# Altium schematic sheet FE_Channel.SchDoc: ThunderScope 1000E
size A3; DrawnBy: Aleksa Bjelogrlic; Revision: 1
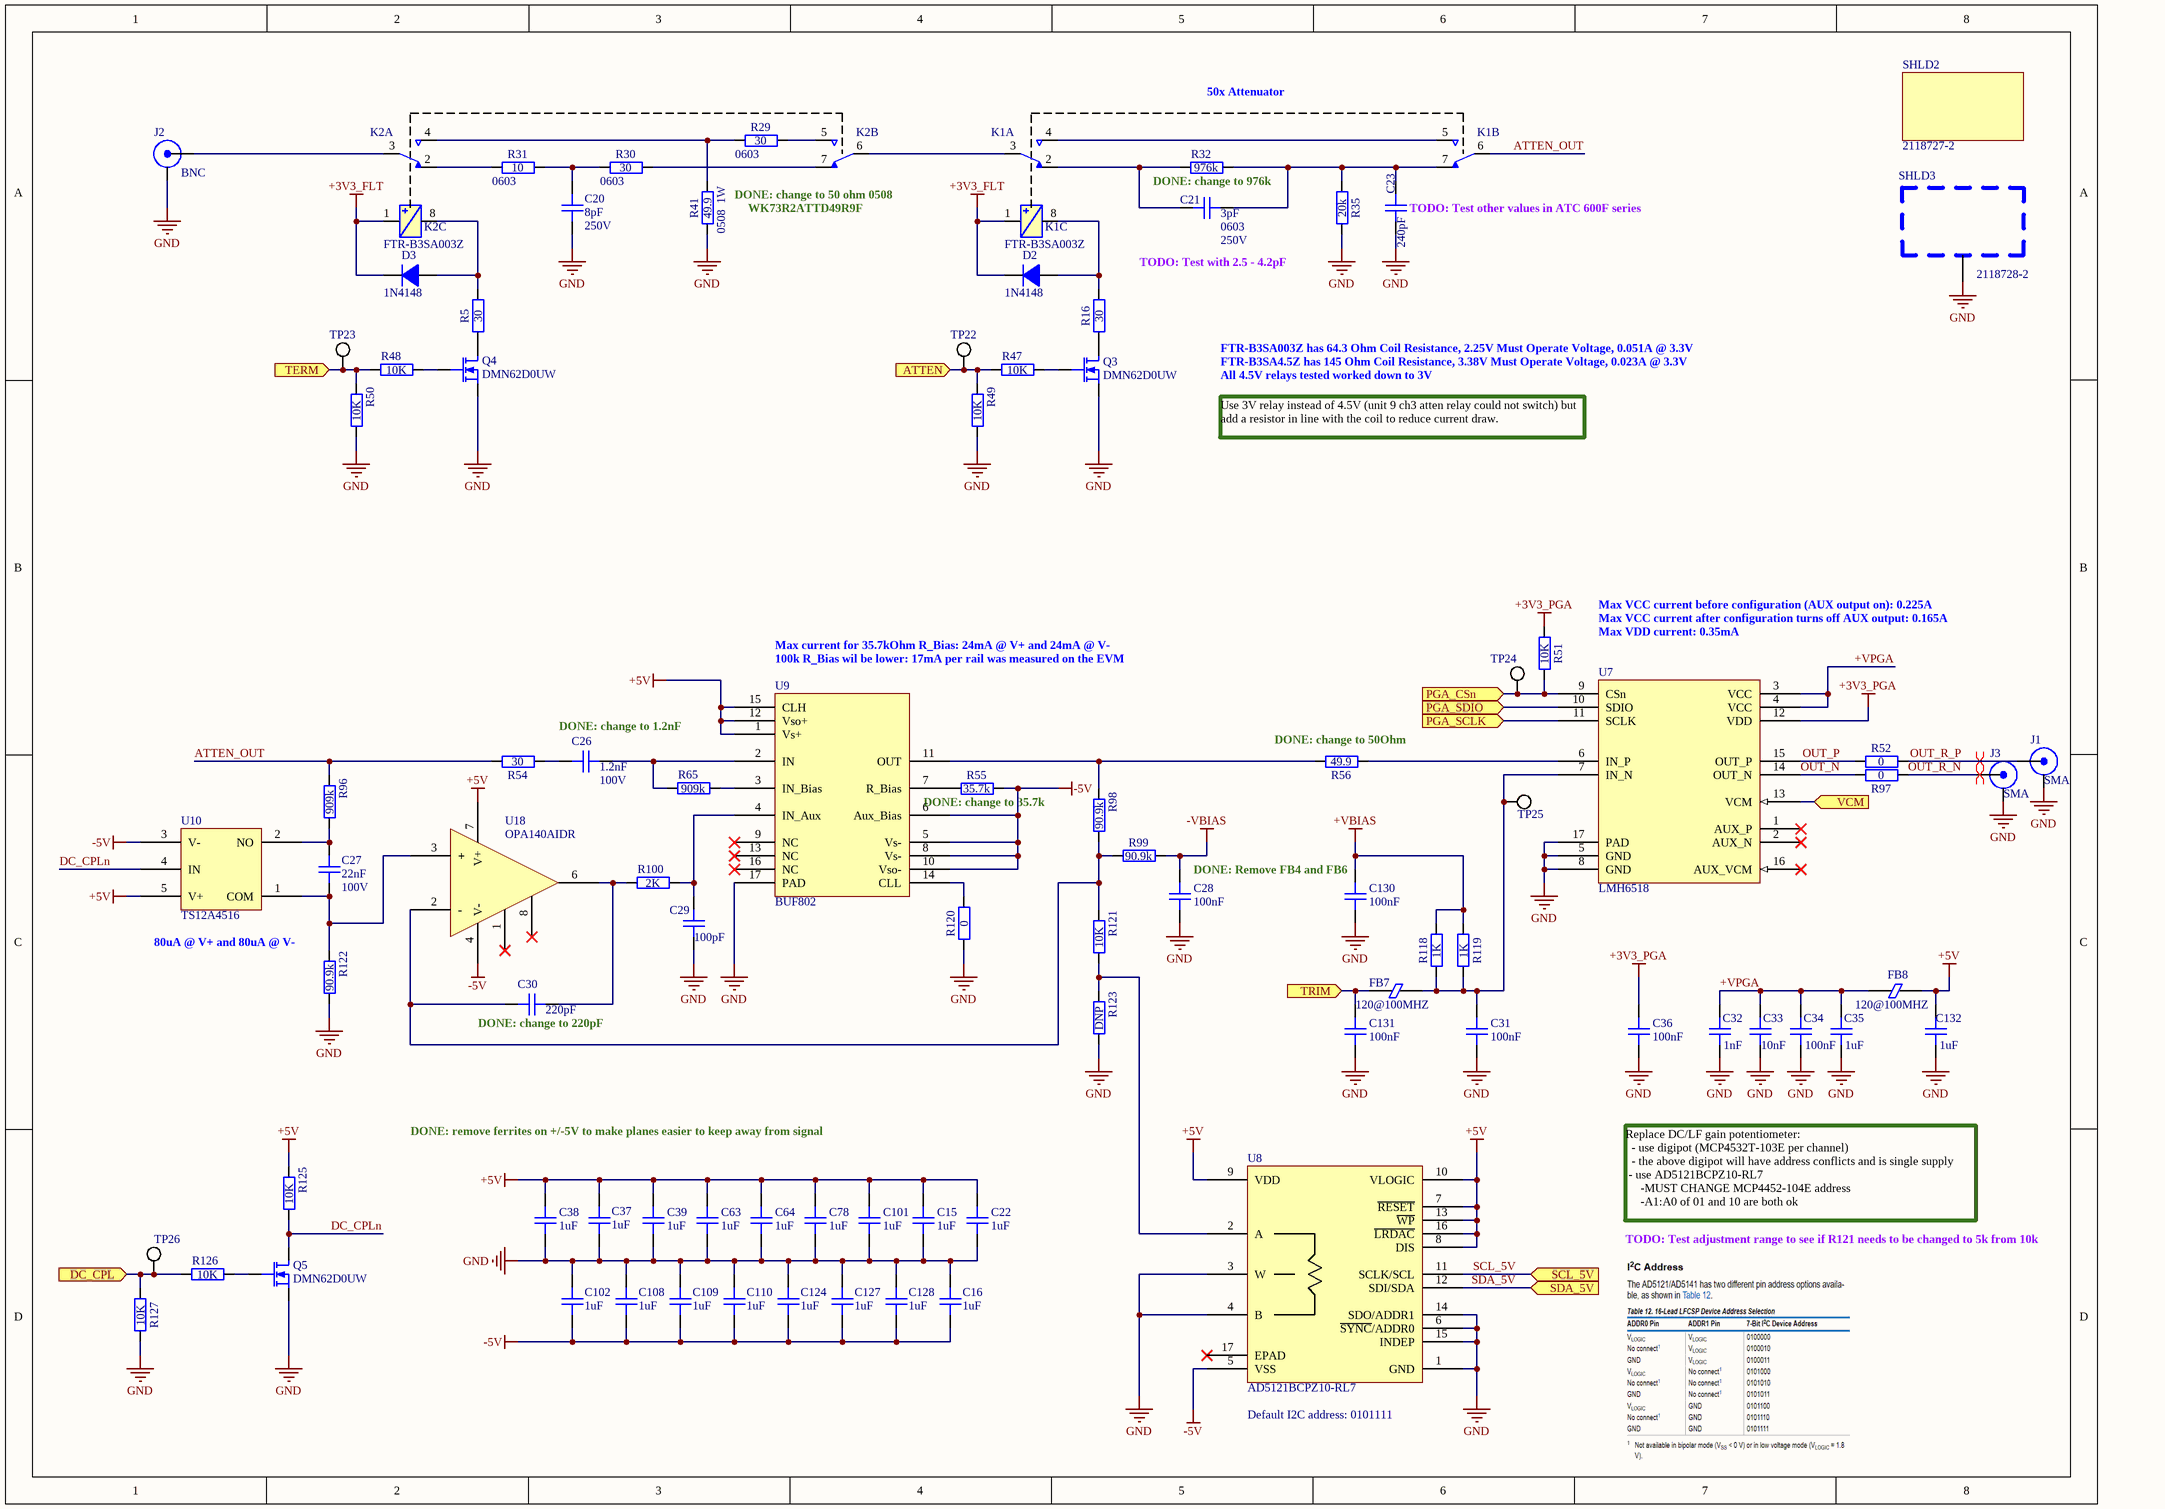
[diagram p0: FE_Channel.SchDoc]

## Parts
C15  1uF  [GEN_C_0402]
C16  1uF  [GEN_C_0402]
C20  8pF  Voltage Rating: 250V  [GEN_C_0603]
C21  3pF  Package: 0603  Voltage Rating: 250V  [GEN_C_0603]
C22  1uF  [GEN_C_0402]
C23  240pF  [GEN_C_0805]
C26  1.2nF  Voltage Rating: 100V  [GEN_C_0603]
C27  22nF  Voltage Rating: 100V  [GEN_C_0603]
C28  100nF  [GEN_C_0402]
C29  100pF  [GEN_C_0402]
C30  220pF  [GEN_C_0402]
C31  100nF  [GEN_C_0402]
C32  1nF  [GEN_C_0402]
C33  10nF  [GEN_C_0402]
C34  100nF  [GEN_C_0402]
C35  1uF  [GEN_C_0402]
C36  100nF  [GEN_C_0402]
C37  1uF  [GEN_C_0402]
C38  1uF  [GEN_C_0402]
C39  1uF  [GEN_C_0402]
C63  1uF  [GEN_C_0402]
C64  1uF  [GEN_C_0402]
C78  1uF  [GEN_C_0402]
C101  1uF  [GEN_C_0402]
C102  1uF  [GEN_C_0402]
C108  1uF  [GEN_C_0402]
C109  1uF  [GEN_C_0402]
C110  1uF  [GEN_C_0402]
C124  1uF  [GEN_C_0402]
C127  1uF  [GEN_C_0402]
C128  1uF  [GEN_C_0402]
C130  100nF  [GEN_C_0402]
C131  100nF  [GEN_C_0402]
C132  1uF  [GEN_C_0402]
D2  1N4148  [GEN_SOD_323]
D3  1N4148  [GEN_SOD_323]
FB7  120@100MHZ  [GEN_R_0402]
FB8  120@100MHZ  [GEN_R_0402]
J1  SMA  [MOL_0733910083]
J2  BNC  [MOL_0731000105]
J3  SMA  [MOL_0733910083]
K1  FTR-B3SA003Z  [FUJ_FTR-B3SA]  (value not drawn)  (parts A,B,C of 3)
K2  FTR-B3SA003Z  [FUJ_FTR-B3SA]  (value not drawn)  (parts A,B,C of 3)
Q3  DMN62D0UW  [GEN_SOT_323]
Q4  DMN62D0UW  [GEN_SOT_323]
Q5  DMN62D0UW  [GEN_SOT_323]
R5  30  [GEN_R_0603]
R16  30  [GEN_R_0603]
R29  30  Package: 0603  [GEN_R_0603]
R30  30  Package: 0603  [GEN_R_0603]
R31  10  Package: 0603  [GEN_R_0603]
R32  976k  [GEN_R_0603]
R35  20k  [GEN_R_0402]
R41  49.9  Package: 0508  Power Rating: 1W  [GEN_R_0508]
R47  10K  [GEN_R_0402]
R48  10K  [GEN_R_0402]
R49  10K  [GEN_R_0402]
R50  10K  [GEN_R_0402]
R51  10K  [GEN_R_0402]
R52  0  [GEN_R_0402]
R54  30  [GEN_R_0603]
R55  35.7k  [GEN_R_0402]
R56  49.9  [GEN_R_0402]
R65  909k  [GEN_R_0402]
R96  909k  [GEN_R_0402]
R97  0  [GEN_R_0402]
R98  90.9k  [GEN_R_0402]
R99  90.9k  [GEN_R_0402]
R100  2K  [GEN_R_0402]
R118  1K  [GEN_R_0402]
R119  1K  [GEN_R_0402]
R120  0  [GEN_R_0402]
R121  10K  [GEN_R_0402]
R122  90.9k  [GEN_R_0402]
R123  DNP  [GEN_R_0402]  (no BOM)
R125  10K  [GEN_R_0402]
R126  10K  [GEN_R_0402]
R127  10K  [GEN_R_0402]
SHLD2  2118727-2  (mechanical)
SHLD3  2118728-2  [TE_2118728-2]
TP22  PCB  [GEN_TP_PCB]  (value not drawn)  (no BOM)
TP23  PCB  [GEN_TP_PCB]  (value not drawn)  (no BOM)
TP24  PCB  [GEN_TP_PCB]  (value not drawn)  (no BOM)
TP25  PCB  [GEN_TP_PCB]  (value not drawn)  (no BOM)
TP26  PCB  [GEN_TP_PCB]  (value not drawn)  (no BOM)
U7  LMH6518  [TI_WQFN_RGH0016A]
U8  AD5121BCPZ10-RL7  [AD_QFN16_CP-16-22]
U9  BUF802  [TI_VQFN_RGT0016C]
U10  TS12A4516  [GEN_SOT23_5_950_2900X1600X1450]
U18  OPA140AIDR  [TI_SOIC8_D0008A]

## Ports
ATTEN (in), DC_CPL (in), PGA_CSn (in), PGA_SCLK (in), PGA_SDIO (in), SCL_5V (in), SDA_5V (in), TERM (in), TRIM (in), VCM (in)

## Nets
+3V3_FLT: D2.1(K) D3.1(K) K1.1 K2.1
+3V3_PGA: C36.2 R51.2 U7.12(VDD)
+5V: C15.2 C22.2 C37.2 C38.1 C39.1 C63.1 C64.2 C78.2 C101.2 C132.2 FB8.2 R125.2 U8.7(~{RESET}) U8.8(DIS) U8.9(VDD) U8.10(VLOGIC) U8.13(~{WP}) U8.16(~{LRDAC}) U9.1(Vs+) U9.12(Vso+) U9.15(CLH) U10.5(V+) U18.7(V+)
+VBIAS: C130.1 R118.2 R119.1
-5V: C16.2 C102.2 C108.2 C109.1 C110.1 C124.1 C127.2 C128.2 R55.2 U8.5(VSS) U9.5(Vs-) U9.6(Aux_Bias) U9.8(Vs-) U9.10(Vso-) U10.3(V-) U18.4(V-)
-VBIAS: C28.1 R99.1
GND: C15.1 C16.1 C20.2 C22.1 C23.1 C28.2 C29.1 C31.2 C32.1 C33.1 C34.1 C35.1 C36.1 C37.1 C38.2 C39.2 C63.2 C64.1 C78.1 C101.1 C102.1 C108.1 C109.2 C110.2 C124.2 C127.1 C128.1 C130.2 C131.2 C132.1 J1.2(SHIELD) J2.2(SHIELD) J3.2(SHIELD) Q3.3(S) Q4.3(S) Q5.3(S) R35.1 R41.1 R49.1 R50.1 R120.1 R122.1 R123.1 R127.1 SHLD3.1 U7.5(GND) U7.8(GND) U7.17(PAD) U8.1(GND) U8.3(W) U8.4(B) U8.6(~{SYNC}/ADDR0) U8.14(SDO/ADDR1) U8.15(INDEP) U9.17(PAD)
+VPGA: C32.2 C33.2 C34.2 C35.2 FB8.1 U7.3(VCC) U7.4(VCC)
ATTEN: R47.2 R49.2 TP22.1 ; port ATTEN
ATTEN_OUT: K1.6 R54.1 R96.2
DC_CPL: R126.2 R127.2 TP26.1 ; port DC_CPL
DC_CPLn: Q5.1(D) R125.1 U10.4(IN)
OUT_N: R97.1 U7.14(OUT_N)
OUT_P: R52.1 U7.15(OUT_P)
OUT_R_N: J3.1(Signal) R97.2
OUT_R_P: J1.1(Signal) R52.2
PGA_CSn: R51.1 TP24.1 U7.9(CSn) ; port PGA_CSn
PGA_SCLK: U7.11(SCLK) ; port PGA_SCLK
PGA_SDIO: U7.10(SDIO) ; port PGA_SDIO
SCL_5V: U8.11(SCLK/SCL) ; port SCL_5V
SDA_5V: U8.12(SDI/SDA) ; port SDA_5V
TERM: R48.2 R50.2 TP23.1 ; port TERM
TRIM: C131.1 FB7.1 ; port TRIM
VCM: U7.13(VCM) ; port VCM
NetC20_1: C20.1 R30.1 R31.2
NetC21_1: C21.1 C23.2 K1.7 R32.2 R35.2
NetC21_2: C21.2 K1.2 R32.1
NetC26_1: C26.1 R65.2 U9.2(IN)
NetC26_2: C26.2 R54.2
NetC27_1: C27.1 R96.1 U10.2(NO)
NetC27_2: C27.2 R122.2 U10.1(COM) U18.3(+)
NetC29_2: C29.2 R100.1 U9.4(IN_Aux)
NetC30_1: C30.1 R100.2 U18.6(OUT)
NetC30_2: C30.2 R98.1 R99.2 R121.2 U18.2(-)
NetC31_1: C31.1 FB7.2 R118.1 R119.2 TP25.1 U7.7(IN_N)
NetD2_2: D2.2(A) K1.8 R16.2
NetD3_2: D3.2(A) K2.8 R5.2
NetJ2_1: J2.1(Signal) K2.3
NetK1_3: K1.3 K2.6
NetK1_4: K1.4 K1.5
NetK2_2: K2.2 R31.1
NetK2_4: K2.4 R29.1 R41.2
NetK2_5: K2.5 R29.2
NetK2_7: K2.7 R30.2
NetQ3_1: Q3.1(D) R16.1
NetQ3_2: Q3.2(G) R47.1
NetQ4_1: Q4.1(D) R5.1
NetQ4_2: Q4.2(G) R48.1
NetQ5_2: Q5.2(G) R126.1
NetR55_1: R55.1 U9.7(R_Bias)
NetR56_1: R56.1 R98.2 U9.11(OUT)
NetR56_2: R56.2 U7.6(IN_P)
NetR65_1: R65.1 U9.3(IN_Bias)
NetR120_2: R120.2 U9.14(CLL)
NetR121_1: R121.1 R123.2 U8.2(A)

Not connected (* = marked no-connect by the designer): U7 1(AUX_P)* 2(AUX_N)* 16(AUX_VCM)*; U8 17(EPAD)*; U9 9(NC)* 13(NC)* 16(NC)*; U18 1(N1)* 8(N2)*

## Layout directives
differential pair; differential pair class 100Z: OUT_R_N, OUT_R_P

## Notes on the sheet
- 50x Attenuator
- (near R32) DONE: change to 976k
- DONE: change to 50 ohm 0508
- WK73R2ATTD49R9F
- (near C23) TODO: Test other values in ATC 600F series
- TODO: Test with 2.5 - 4.2pF
- FTR-B3SA003Z has 64.3 Ohm Coil Resistance, 2.25V Must Operate Voltage, 0.051A @ 3.3V
- FTR-B3SA4.5Z has 145 Ohm Coil Resistance, 3.38V Must Operate Voltage, 0.023A @ 3.3V
- All 4.5V relays tested worked down to 3V
- Use 3V relay instead of 4.5V (unit 9 ch3 atten relay could not switch) but add a resistor in line with the coil to reduce current draw.
- Max current for 35.7kOhm R_Bias: 24mA @ V+ and 24mA @ V-
- Max VCC current before configuration (AUX output on): 0.225A
- Max VCC current after configuration turns off AUX output: 0.165A
- Max VDD current: 0.35mA
- (near U9) 100k R_Bias wil be lower: 17mA per rail was measured on the EVM
- DONE: change to 1.2nF
- (near R56) DONE: change to 50Ohm
- DONE: change to 35.7k
- DONE: Remove FB4 and FB6
- 80uA @ V+ and 80uA @ V-
- (near C30) DONE: change to 220pF
- DONE: remove ferrites on +/-5V to make planes easier to keep away from signal
- Replace DC/LF gain potentiometer:
  - use digipot (MCP4532T-103E per channel)
  - the above digipot will have address conflicts and is single supply
  - use AD5121BCPZ10-RL7
  -MUST CHANGE MCP4452-104E address
  -A1:A0 of 01 and 10 are both ok
- TODO: Test adjustment range to see if R121 needs to be changed to 5k from 10k
- (near U8) Default I2C address: 0101111

## Library data of the parts
C15 C16 C22 C35 C37-C39 C63 C64 C78 C101 C102 C108-C110 C124 C127 C128 C132 = CAP 1uF 25V X5R 0402: Manufacturer: Murata; Manufacturer Part Number: GRM155R61E105KA12D; Voltage Rating: 25V; Package: 0402; Supplier 1: Mouser; Supplier Part Number 1: 81-GRM155R61E105KA2D; Value: 1uF
C20 = CAP 8pF 250V C0G 0603: Manufacturer: KEMET; Manufacturer Part Number: CBR06C809BAGAC; Value: 8pF; Supplier 1: Mouser; Supplier Part Number 1: 80-CBR06C809BAGAC; Package: 0603
C21 = CAP 3pF 250V C0G 0603: Manufacturer: KEMET; Manufacturer Part Number: CBR06C309BAGAC; Supplier 1: Mouser; Supplier Part Number 1: 80-CBR06C309BAG; Value: 3pF
C23 = CAP 240pF 250V C0G 0805: Manufacturer: Kyocera AVX; Manufacturer Part Number: 600F241FT250XT; Voltage Rating: 250V; Temperature Coefficient: C0G; Package: 0805; Supplier 1: Mouser; Supplier Part Number 1: 581-600F241FT; Value: 240pF
C26 = CAP 1.2nF 100V C0G 0603: Manufacturer: Murata; Manufacturer Part Number: GCM1885C2A122FA16D; Temperature Coefficient: C0G; Package: 0603; Value: 1.2nF; Supplier 1: Mouser; Supplier Part Number 1: 81-GCM1885C2A122FA6D
C27 = CAP 22nF 100V X7R 0603: Manufacturer: Murata; Manufacturer Part Number: GCM188R72A223KA37D; Package: 0603; Value: 22nF; Supplier 1: Mouser; Supplier Part Number 1: 81-GCM188R72A223KA7D
C28 C31 C34 C36 C130 C131 = CAP 100nF 16V X7R 0402: House Part Number: C-100nF-0402-002; Manufacturer: Murata; Manufacturer Part Number: GCM155R71C104KA55D; Voltage Rating: 16V; Package: 0402; Supplier 1: Mouser; Supplier Part Number 1: 81-GCM155R71C104KA5D; Value: 100nF
C29 = CAP 100pF 50V C0G 0402: Manufacturer: Murata; Manufacturer Part Number: GCM1555C1H101FA16D; Temperature Coefficient: C0G; Voltage Rating: 50V; Package: 0402; Value: 100pF; Supplier 1: Mouser; Supplier Part Number 1: 81-GCM1555C1H101FA6D
C30 = CAP 220pF 50V C0G 0402: Manufacturer: Murata; Manufacturer Part Number: GCM1555C1H221FA16J; Temperature Coefficient: C0G; Voltage Rating: 50V; Package: 0402; Value: 220pF; Supplier 1: Mouser; Supplier Part Number 1: 81-GCM1555C1H221FA6J
C32 = CAP 1nF 50V C0G 0402: Manufacturer: Murata; Manufacturer Part Number: GRM1555C1H102FA01D; Voltage Rating: 50V; Package: 0402; Supplier 1: Mouser; Supplier Part Number 1: 81-GRM1555C1H102FA1D; Value: 1nF
C33 = CAP 10nF 50V X7R 0402: House Part Number: C-10nF-0402-002; Manufacturer: Murata; Manufacturer Part Number: GRM155R71H103KA88J; Voltage Rating: 50V; Package: 0402; Supplier 1: Mouser; Supplier Part Number 1: 81-GRM155R71H103KA8J; Value: 10nF
D2 D3 = DIODE 1N4148: Manufacturer: Diodes; Manufacturer Part Number: 1N4148WS-7-F; Supplier 1: Mouser; Supplier Part Number 1: 621-1N4148WS-F
FB7 FB8 = FERRITE BEAD 120 OHM 0402: House Part Number: BLM15PX121SN1D; Manufacturer: Murata; Supplier 1: Mouser; Supplier Part Number 1: 81-BLM15PX121SN1D; Manufacturer Part Number: BLM15PX121SN1D
J1 J3 = SMA JACK R/A: Manufacturer: Molex; Manufacturer Part Number: 73100-0105; Supplier 1: Digi-Key; Supplier Part Number 1: WM26450-ND
J2 = BNC JACK R/A: Manufacturer: Molex; Manufacturer Part Number: 73100-0105; Supplier 1: Mouser; Supplier Part Number 1: 538-73100-0105
K1 K2 = RELAY DPDT-NO FTR-B3SA003Z: Manufacturer: Fujitsu; Manufacturer Part Number: FTR-B3SA003Z
Q3-Q5 = NMOS DMN62D0UW: House Part Number: DMN62D0UW-7; Manufacturer: Diodes; Vdss: 60V; Supplier 1: Mouser; Supplier Part Number 1: 621-DMN62D0UW-7; Manufacturer Part Number: DMN62D0UW-7
R5 R16 R29 R30 R54 = RES 30 OHM 1% 1/3W 0603: Manufacturer: KOA Speer; Manufacturer Part Number: SG73P1JTTD30R0F; Tolerance: 1%; Value: 30; Supplier 1: Mouser; Supplier Part Number 1: 660-SG73P1JTTD30R0F
  R5 R16 R54: Package: 0603
R31 = RES 10 OHM 1% 1/3W 0603: Manufacturer: KOA Speer; Manufacturer Part Number: SG73P1JTTD10R0F; Tolerance: 1%; Value: 10; Supplier 1: Mouser; Supplier Part Number 1: 660-SG73P1JTTD10R0F
R32 = RES 976k OHM 1% 1/10W 0603: Manufacturer: KOA Speer; Manufacturer Part Number: RK73H1JTTD9763F; Tolerance: 1%; Package: 0603; Value: 976k; Supplier 1: Mouser; Supplier Part Number 1: 660-RK73H1JTTD9763F
R35 = RES 20K OHM 1% 1/16W 0402: Manufacturer: Yageo; Manufacturer Part Number: RC0402FR-0720KL; Tolerance: 1%; Package: 0402; Supplier 1: Mouser; Supplier Part Number 1: 603-RC0402FR-0720KL; Value: 20k
R41 = RES 49.9 OHM 1% 1W 0508: Manufacturer: KOA Speer; Manufacturer Part Number: WK73R2ATTD49R9F; Tolerance: 1%; Value: 49.9; Supplier 1: Mouser; Supplier Part Number 1: 660-WK73R2ATTD49R9F
R47-R51 R121 R125-R127 = RES 10K OHM 1% 1/10W 0402: Manufacturer: Panasonic; Manufacturer Part Number: ERJ-2RKF1002X; Tolerance: 1%; Package: 0402; Supplier 1: Mouser; Supplier Part Number 1: 667-ERJ-2RKF1002X; Value: 10K
R52 R97 R120 = RES 0 OHM 1/16W 0402: Manufacturer: Yageo; Manufacturer Part Number: RC0402JR-070RL; Package: 0402; Supplier 1: Mouser; Supplier Part Number 1: 603-RC0402JR-070RL; Value: 0
R55 = RES 35.7K OHM 1% 1/16W 0402: Manufacturer: Yageo; Manufacturer Part Number: RC0402FR-0735K7L; Tolerance: 1%; Package: 0402; Value: 35.7k; Supplier 1: Mouser; Supplier Part Number 1: 603-RC0402FR-0735K7L
R56 = RES 49.9 OHM 1% 1/10W 0402: Manufacturer: Yageo; Manufacturer Part Number: RC0402FR-0749R9L; Tolerance: 1%; Package: 0402; Value: 49.9; Supplier 1: Mouser; Supplier Part Number 1: 603-RC0402FR-0749R9L
R65 R96 = RES 909K OHM 1% 1/16W 0402: Manufacturer: Yageo; Manufacturer Part Number: RC0402FR-07909KL; Tolerance: 1%; Package: 0402; Supplier 1: Mouser; Supplier Part Number 1: 603-RC0402FR-07909KL; Value: 909k
R98 R99 R122 = RES 90.9K OHM 1% 1/16W 0402: Manufacturer: Yageo; Manufacturer Part Number: RC0402FR-0790K9L; Tolerance: 1%; Package: 0402; Supplier 1: Mouser; Supplier Part Number 1: 603-RC0402FR-0790K9L; Value: 90.9k
R100 = RES 2K OHM 1% 1/16W 0402: Manufacturer: Yageo; Manufacturer Part Number: RC0402FR-072KL; Tolerance: 1%; Package: 0402; Supplier 1: Mouser; Supplier Part Number 1: 603-RC0402FR-072KL; Value: 2K
R118 R119 = RES 1K OHM 1% 1/10W 0402: House Part Number: R-1K-0402-1%-001; Manufacturer: Yageo; Manufacturer Part Number: RC0402FR-071KL; Tolerance: 1%; Package: 0402; Supplier 1: Mouser; Supplier Part Number 1: 603-RC0402FR-071KL; Value: 1K
R123 = RES DNP 0402: Tolerance: 1%; Package: 0402; Value: DNP
SHLD2 = SHIELD 2118727-2: Manufacturer: TE Connectivity AMP; Supplier 1: Mouser; Supplier Part Number 1: 571-2118727-2; Manufacturer Part Number: 2118727-2
SHLD3 = SHIELD 2118728-2: Manufacturer: TE Connectivity; Supplier 1: Mouser; Supplier Part Number 1: 571-2118728-2; Manufacturer Part Number: 2118728-2
TP22-TP26 = TP PCB 1mm
U7 = IC PGA LMH6518: Manufacturer: Texas Instruments; Manufacturer Part Number: LMH6518SQE/NOPB; Supplier 1: Texas Instruments; Supplier Part Number 1: LMH6518SQX/NOPB
U8 = IC DIGIPOT SINGLE AD5121BCPZ10-RL7: Manufacturer: Analog Devices; Manufacturer Part Number: AD5121BCPZ10-RL7; Supplier 1: Mouser; Supplier Part Number 1: 584-AD5121BCPZ10-R7
U9 = IC BUFFER AMP BUF802: Manufacturer: Texas Instruments; Manufacturer Part Number: BUF802IRGTR; Supplier 1: Texas Instruments; Supplier Part Number 1: BUF802IRGTR
U10 = IC SWITCH SPST TS12A4516DBVR: Manufacturer: Texas Instruments; Supplier 1: Texas Instruments; Supplier Part Number 1: TS12A4516DBVR; Manufacturer Part Number: TS12A4516DBVR
U18 = IC OPAMP OPA140: Manufacturer: Texas Instruments; Supplier 1: Texas Instruments; Supplier Part Number 1: OPA140AIDR; Manufacturer Part Number: OPA140AIDR